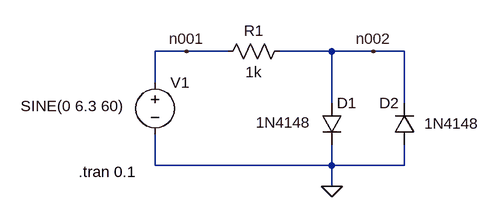
[diagram p0: schematic c01ex43s01.asc]
c01ex43s01.asc, the LTspice schematic file:
Version 4
SHEET 1 880 680
WIRE 112 64 64 64
WIRE 176 64 112 64
WIRE 336 64 256 64
WIRE 400 64 336 64
WIRE 448 64 400 64
WIRE 64 112 64 64
WIRE 336 144 336 64
WIRE 448 144 448 64
WIRE 64 240 64 192
WIRE 336 240 336 208
WIRE 336 240 64 240
WIRE 448 240 448 208
WIRE 448 240 336 240
WIRE 336 272 336 240
FLAG 336 272 0
FLAG 112 64 n001
FLAG 400 64 n002
SYMBOL voltage 64 96 R0
WINDOW 3 -207 52 Left 2
WINDOW 123 -116 56 Left 2
WINDOW 39 0 0 Left 0
SYMATTR InstName V1
SYMATTR Value SINE(0 6.3 60)
SYMBOL res 272 48 R90
WINDOW 0 0 56 VBottom 2
WINDOW 3 32 56 VTop 2
SYMATTR InstName R1
SYMATTR Value 1k
SYMBOL diode 320 144 R0
WINDOW 3 -101 30 Left 2
SYMATTR InstName D1
SYMATTR Value 1N4148
SYMBOL diode 464 208 R180
WINDOW 0 24 64 Left 2
WINDOW 3 -99 33 Left 2
SYMATTR InstName D2
SYMATTR Value 1N4148
TEXT -54 250 Left 2 !.tran 0.1

The netlist it stands for:
* c01ex43s01.asc
V1 n001 0 SINE(0 6.3 60)
R1 n002 n001 1k
D1 n002 0 1N4148
D2 0 n002 1N4148
.model D D
.lib standard.dio
.tran 0.1
.backanno
.end